# Altium project PogoPinBoard.PrjPCB
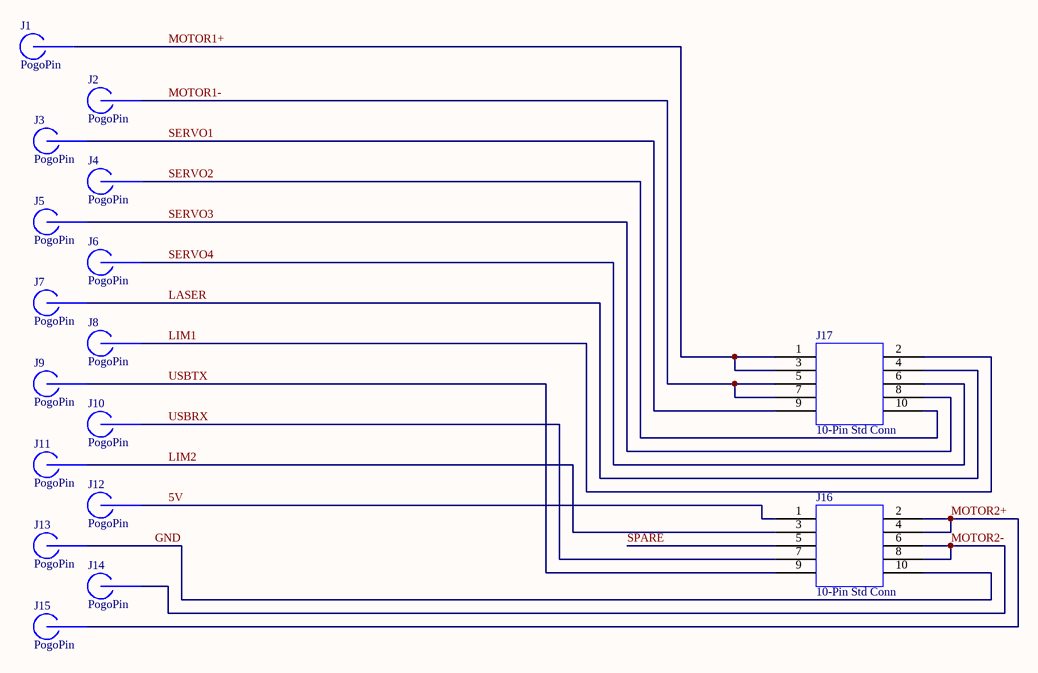
[diagram p0: PogoPinSide.SchDoc]
1 sheet, 17 parts. Net scope: global (net labels, ports and power ports of the same name join across sheets).
Board file: PogoPinSideBrd.PcbDoc

## Sheet PogoPinSide.SchDoc
size A

### Parts
J1  PogoPin  [PCBComponent_1]
J2  PogoPin  [PCBComponent_1]
J3  PogoPin  [PCBComponent_1]
J4  PogoPin  [PCBComponent_1]
J5  PogoPin  [PCBComponent_1]
J6  PogoPin  [PCBComponent_1]
J7  PogoPin  [PCBComponent_1]
J8  PogoPin  [PCBComponent_1]
J9  PogoPin  [PCBComponent_1]
J10  PogoPin  [PCBComponent_1]
J11  PogoPin  [PCBComponent_1]
J12  PogoPin  [PCBComponent_1]
J13  PogoPin  [PCBComponent_1]
J14  PogoPin  [PCBComponent_1]
J15  PogoPin  [PCBComponent_1]
J16  10-Pin Std Conn  [FTSH-105-01-F-DV]
J17  10-Pin Std Conn  [FTSH-105-01-F-DV]

### Nets
5V: J12.1(Pin) J16.1(Pin)
GND: J13.1(Pin) J16.10(Pin)
LASER: J7.1(Pin) J17.4(Pin)
LIM1: J8.1(Pin) J17.2(Pin)
LIM2: J11.1(Pin) J16.3(Pin)
MOTOR1+: J1.1(Pin) J17.1(Pin) J17.3(Pin)
MOTOR1-: J2.1(Pin) J17.5(Pin) J17.7(Pin)
MOTOR2+: J15.1(Pin) J16.2(Pin) J16.4(Pin)
MOTOR2-: J14.1(Pin) J16.6(Pin) J16.8(Pin)
SERVO1: J3.1(Pin) J17.9(Pin)
SERVO2: J4.J4(Pin) J17.10(Pin)
SERVO3: J5.1(Pin) J17.8(Pin)
SERVO4: J6.1(Pin) J17.6(Pin)
SPARE: J16.5(Pin)
USBRX: J10.1(Pin) J16.7(Pin)
USBTX: J9.1(Pin) J16.9(Pin)